# Altium project ELM327-based OBD-II interface.PrjPcb
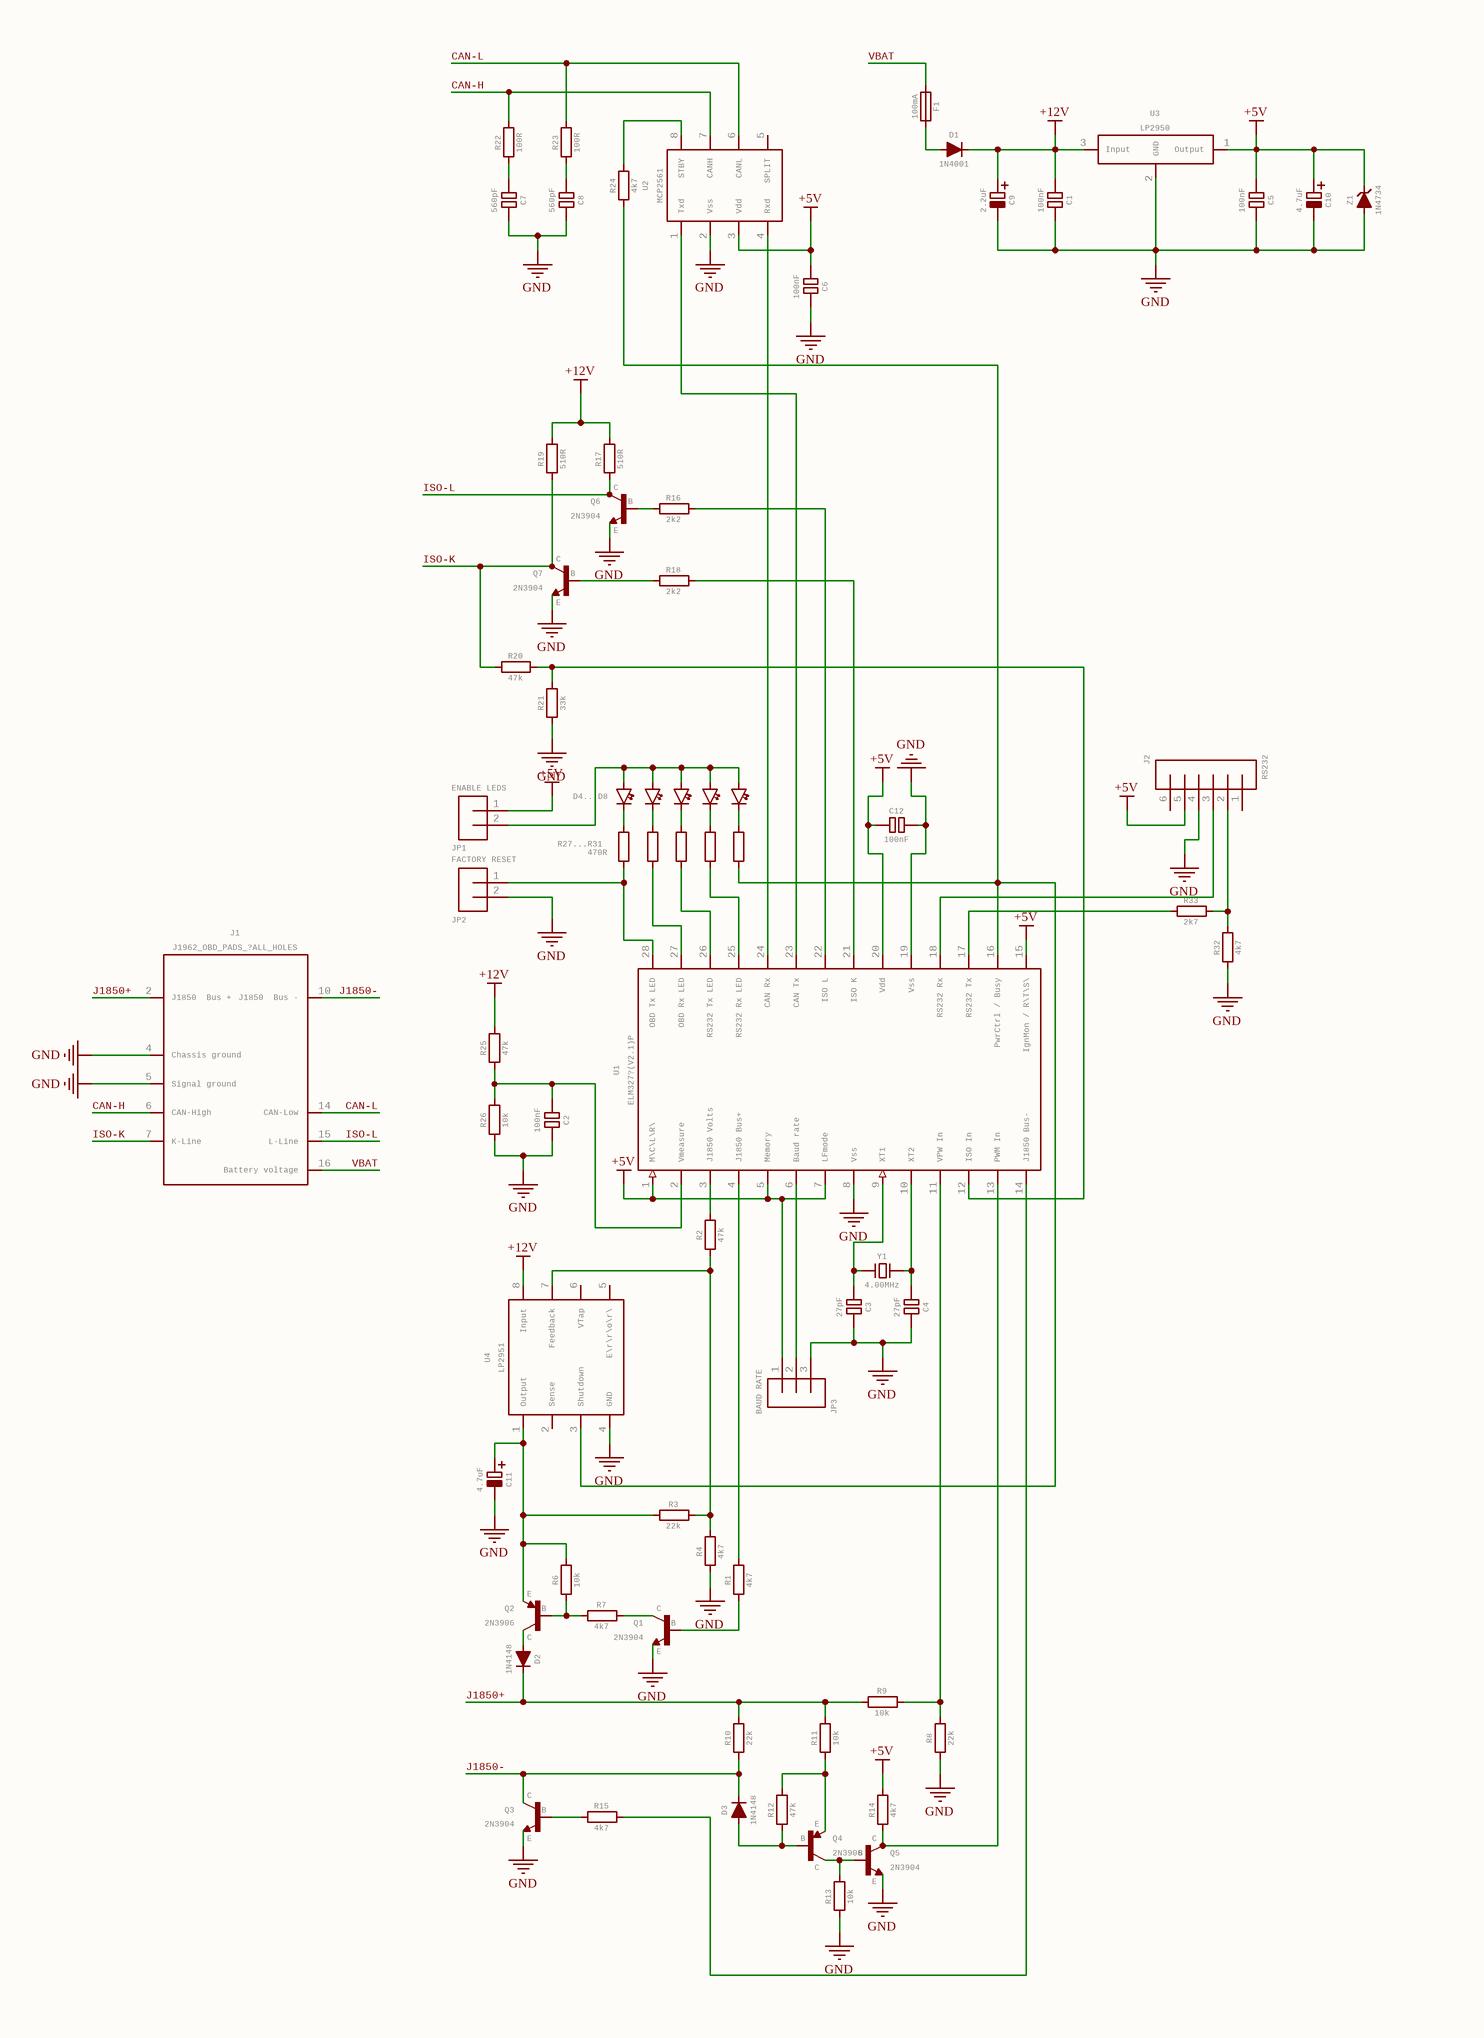
[diagram p0: ELM327-based OBD-II interface.SchDoc]
1 sheet, 71 parts. Net scope: global (net labels, ports and power ports of the same name join across sheets).
Board file: ELM327-based OBD-II interface.PcbDoc

## Sheet ELM327-based OBD-II interface.SchDoc
size 260 x 358 mm; Origin: Eagle; OriginPath: C:\Users\Bimbo\Downloads\ELM327-based OBD-II interface.sch; OriginSheet: 1

### Parts
C1  100nF  [MLCC-5.08]
C2  100nF  [MLCC-5.08]
C3  27pF  [MLCC-5.08]
C4  27pF  [MLCC-5.08]
C5  100nF  [MLCC-5.08]
C6  100nF  [MLCC-5.08]
C7  560pF  [MLCC-5.08]
C8  560pF  [MLCC-5.08]
C9  2.2uF  [E2-5]
C10  4.7uF  [TANTALUM-5.08]
C11  4.7uF  [TANTALUM-5.08]
C12  100nF  [MLCC-5.08]
D1  1N4001  [DO-41]
D2  1N4148  [DO-35]
D3  1N4148  [DO-35]
D4  OBD Tx  [LED_5MM]  (value not drawn)
D5  OBD Rx  [LED_5MM]  (value not drawn)
D6  RS232 Tx  [LED_5MM]  (value not drawn)
D7  RS232 Rx  [LED_5MM]  (value not drawn)
D8  ON  [LED_5MM]  (value not drawn)
F1  100mA  [FUSE]
J1  J1962_OBD_PADS_?ALL_HOLES  J1850
Bus+: J1850 / Bus +  Signalground: Signal ground  J1850
Bus-: J1850 / Bus -  Batteryvoltage: Battery voltage  Chassisground: Chassis ground  [J1962_OBD_PADS_ALL_HOLES]
J2  RS232  [HEADER_1X6]
JP1  ENABLE LEDS  [HEADER_1X2]
JP2  FACTORY RESET  [HEADER_1X2]
JP3  BAUD RATE  [HEADER_1X3]
Q1  2N3904  [TO-92]
Q2  2N3906  [TO-92]
Q3  2N3904  [TO-92]
Q4  2N3906  [TO-92]
Q5  2N3904  [TO-92]
Q6  2N3904  [TO-92]
Q7  2N3904  [TO-92]
R1  4k7  [MF12-1/8W]
R2  47k  [MF12-1/8W]
R3  22k  [MF12-1/8W]
R4  4k7  [MF12-1/8W]
R6  10k  [MF12-1/8W]
R7  4k7  [MF12-1/8W]
R8  22k  [MF12-1/8W]
R9  10k  [MF12-1/8W]
R10  22k  [MF12-1/8W]
R11  10k  [MF12-1/8W]
R12  47k  [MF12-1/8W]
R13  10k  [MF12-1/8W]
R14  4k7  [MF12-1/8W]
R15  4k7  [MF12-1/8W]
R16  2k2  [MF12-1/8W]
R17  510R  [MF50-1/2W]
R18  2k2  [MF12-1/8W]
R19  510R  [MF50-1/2W]
R20  47k  [MF12-1/8W]
R21  33k  [MF12-1/8W]
R22  100R  [MF12-1/8W]
R23  100R  [MF12-1/8W]
R24  4k7  [MF12-1/8W]
R25  47k  [MF12-1/8W]
R26  10k  [MF12-1/8W]
R27  470R  [MF12-1/8W]  (value not drawn)
R28  470R  [MF12-1/8W]  (value not drawn)
R29  470R  [MF12-1/8W]  (value not drawn)
R30  470R  [MF12-1/8W]  (value not drawn)
R31  470R  [MF12-1/8W]  (value not drawn)
R32  4k7  [MF12-1/8W]
R33  2k7  [MF12-1/8W]
U1  ELM327?(V2.1)P  !MCLR: M\C\L\R\  J1850Volts: J1850 Volts  J1850Bus+: J1850 Bus+  Baudrate: Baud rate  VPWIn: VPW In  ISOIn: ISO In  PWMIn: PWM In  J1850Bus-: J1850 Bus-  OBDTxLED: OBD Tx LED  OBDRxLED: OBD Rx LED  RS232TxLED: RS232 Tx LED  RS232RxLED: RS232 Rx LED  CANRx: CAN Rx  CANTx: CAN Tx  ISOL: ISO L  ISOK: ISO K  RS232Rx: RS232 Rx  RS232Tx: RS232 Tx  PwrCtrl/Busy: PwrCtrl / Busy  IgnMon/!RTS: IgnMon / R\T\S\  [SPDIP(28)]
U2  MCP2561  [PDIP]
U3  LP2950  [TO-92]
U4  LP2951  !Error: E\r\r\o\r\  [PDIP-8]
Y1  4.00MHz  [HC49]
Z1  1N4734  [DO-41]

### Nets
+5V: C5.+ C6.+ C10.+ C12.+ J2.5 JP1.1 JP3.1 R14.2 U1.1(~{MCLR}) U1.5(MEMORY) U1.7(LFMODE) U1.15(IGNMON/~{RTS}) U1.20(VDD) U2.3(VDD) U3.1(OUTPUT) Z1.C
+12V: C1.+ C9.+ D1.C R17.2 R19.2 R25.2 U3.3(INPUT) U4.8(INPUT)
GND: C1.- C2.- C3.- C4.- C5.- C6.- C7.- C8.- C9.- C10.- C11.- C12.- J1.4 J1.5 J2.4 JP2.2 JP3.3 Q1.E Q3.E Q5.E Q6.E Q7.E R4.1 R8.1 R13.1 R21.1 R26.1 R32.1 U1.8(VSS) U1.19(VSS) U2.2(VSS) U3.2(GND) U4.4(GND) Z1.A
CAN-H: J1.6 R22.2 U2.7(CANH)
CAN-L: J1.14 R23.2 U2.6(CANL)
ISO-K: J1.7 Q7.C R19.1 R20.1
ISO-L: J1.15 Q6.C R17.1
J1850+: D2.C J1.2 R9.1 R10.2 R11.2
J1850-: D3.C J1.10 Q3.C R10.1
VBAT: F1.1 J1.16
NetC2_+: C2.+ R25.1 R26.2 U1.2(VMEASURE)
NetC3_+: C3.+ U1.9(XT1) Y1.1
NetC4_+: C4.+ U1.10(XT2) Y1.2
NetC7_+: C7.+ R22.1
NetC8_+: C8.+ R23.1
NetC11_+: C11.+ Q2.E R3.1 R6.2 U4.1(OUTPUT)
NetD1_A: D1.A F1.2
NetD2_A: D2.A Q2.C
NetD3_A: D3.A Q4.B R12.1
NetD4_A: D4.A D5.A D6.A D7.A D8.A JP1.2
NetD4_C: D4.C R27.2
NetD5_C: D5.C R28.2
NetD6_C: D6.C R29.2
NetD7_C: D7.C R30.2
NetD8_C: D8.C R31.2
NetJ2_2: J2.2 R32.2 R33.2
NetJ2_3: J2.3 U1.18(RS232_RX)
NetJP2_1: JP2.1 R27.1 U1.28(OBD_TX_LED)
NetJP3_2: JP3.2 U1.6(BAUD_RATE)
NetQ1_B: Q1.B R1.1
NetQ1_C: Q1.C R7.2
NetQ2_B: Q2.B R6.1 R7.1
NetQ3_B: Q3.B R15.1
NetQ4_C: Q4.C Q5.B R13.2
NetQ4_E: Q4.E R11.1 R12.2
NetQ5_C: Q5.C R14.1 U1.13(PWM_IN)
NetQ6_B: Q6.B R16.1
NetQ7_B: Q7.B R18.1
NetR1_2: R1.2 U1.4(J1850_BUS+)
NetR2_1: R2.1 R3.2 R4.2 U4.7(FEEDBACK)
NetR2_2: R2.2 U1.3(J1850_VOLTS)
NetR8_2: R8.2 R9.2 U1.11(VPW_IN)
NetR15_2: R15.2 U1.14(J1850_BUS-)
NetR16_2: R16.2 U1.22(ISO_L)
NetR18_2: R18.2 U1.21(ISO_K)
NetR20_2: R20.2 R21.2 U1.12(ISO_IN)
NetR24_1: R24.1 R31.1 U1.16(PWRCTRL/BUSY) U4.3(SHUTDOWN)
NetR24_2: R24.2 U2.8(STBY)
NetR28_1: R28.1 U1.27(OBD_RX_LED)
NetR29_1: R29.1 U1.26(RS232_TX_LED)
NetR30_1: R30.1 U1.25(RS232_RX_LED)
NetR33_1: R33.1 U1.17(RS232_TX)
NetU1_23: U1.23(CAN_TX) U2.1(TXD)
NetU1_24: U1.24(CAN_RX) U2.4(RXD)

Not connected (* = marked no-connect by the designer): J2 1 6; U2 5(SPLIT); U4 2(SENSE) 5(ERROROUTPUT) 6(VOTAP)

### Notes on the sheet
- (near D4) D4...D8
- (near R27) R27...R31
  470R

### Library data of the parts
C1-C8 C12 = C(MLCC-5.08): GateName_1: G$1; SymbolName_1: C; DeviceName: (MLCC-5.08); LibraryName: Capacitor; DeviceSetName: C
C9 = CPOL(E2-5): GateName_1: G$1; SymbolName_1: CPOL; DeviceName: (E2-5); LibraryName: Capacitor; DeviceSetName: CPOL
C10 C11 = CPOL(TANTALUM-5.08): GateName_1: G$1; SymbolName_1: CPOL; DeviceName: (TANTALUM-5.08); LibraryName: Capacitor; DeviceSetName: CPOL
D1 = DIODE(?)DO-41: Diode; GateName_1: G$1; SymbolName_1: DIODE; DeviceName: DO-41; LibraryName: diode; DeviceSetName: DIODE(?)
D2 D3 = DIODE(?)DO-35: Diode; GateName_1: G$1; SymbolName_1: DIODE; DeviceName: DO-35; LibraryName: diode; DeviceSetName: DIODE(?)
D4-D8 = LED(?)5MM: GateName_1: G$1; SymbolName_1: LED; DeviceName: 5MM; DeviceSetName: LED(?); LibraryName: diode
F1 = FUSE: GateName_1: G$1; SymbolName_1: FUSE; LibraryName: fuse; DeviceSetName: FUSE
J1 = J1962_OBD_PADS_?ALL_HOLES: GateName_1: G$1; SymbolName_1: J1962_OBD_ONLY; DeviceName: ALL_HOLES; LibraryName: J1962; DeviceSetName: J1962_OBD_PADS_?; CAN-High: CAN-High; K-Line: K-Line; CAN-Low: CAN-Low; L-Line: L-Line
J2 = HEADER_1X6: GateName_1: G$1; SymbolName_1: HEADER_1X6; LibraryName: HEADERS; DeviceSetName: HEADER_1X6
JP1 JP2 = HEADER_1X2: GateName_1: G$1; SymbolName_1: HEADER_1X2; LibraryName: HEADERS; DeviceSetName: HEADER_1X2
JP3 = HEADER_1X3: GateName_1: G$1; SymbolName_1: HEADER_1X3; LibraryName: HEADERS; DeviceSetName: HEADER_1X3
Q1 Q3 Q5-Q7 = NPN(TO-92): GateName_1: G$1; SymbolName_1: NPN; DeviceName: (TO-92); LibraryName: Transistor; DeviceSetName: NPN; C: C; E: E; B: B
Q2 Q4 = PNP(TO-92): GateName_1: G$1; SymbolName_1: PNP; DeviceName: (TO-92); LibraryName: Transistor; DeviceSetName: PNP; C: C; E: E; B: B
R1-R4 R6-R16 R18 R20-R33 = R-EU-?MF12-1/8W: GateName_1: G$1; SymbolName_1: R-EU; DeviceSetName: R-EU-?; DeviceName: MF12-1/8W; LibraryName: Resistor
R17 R19 = R-EU-?MF50-1/2W: GateName_1: G$1; SymbolName_1: R-EU; DeviceSetName: R-EU-?; DeviceName: MF50-1/2W; LibraryName: Resistor
U1 = ELM327?(V2.1)P: ELM327 - OBD to RS232 Interpreter (v2.1) based on Microchip Technology Inc.'s PIC18F2480 (www.microchip.com)    All versions of the ELM327 support the standard OBDII protocols. In addition, the IC supports various other protocols to varying degrees.   Version 2.1 is the most recent revision.   More info on Elm Electronics Inc..; GateName_1: G$1; SymbolName_1: ELM327-V2.1; DeviceName: P; LibraryName: Elm Electronics; DeviceSetName: ELM327?(V2.1); Vmeasure: Vmeasure; Memory: Memory; LFmode: LFmode; Vss: Vss; XT1: XT1; XT2: XT2; Vdd: Vdd
U2 = MCP2561FD(?)PDIP: High-Speed CAN Flexible Data Rate Transceiver; GateName_1: G$1; SymbolName_1: MCP2561FD; DeviceName: PDIP; LibraryName: Microchip MCP2561; DeviceSetName: MCP2561FD(?); Txd: Txd; Vss: Vss; Vdd: Vdd; Rxd: Rxd; STBY: STBY; CANH: CANH; CANL: CANL; SPLIT: SPLIT
U3 = LP2950*?Z-5.0: GateName_1: G$1; DeviceName: Z-5.0; OUTPUT_VOLTAGE: 5.0 V; OUTPUT_VOLTAGE_PRECISION: 0.5%; SymbolName_1: LP2950; LibraryName: ON Semiconductor LP2950, LP2951, NCV2951; DeviceSetName: LP2950*?; Output: Output; Input: Input; GND: GND
U4 = LP2951*?N: GateName_1: G$1; DeviceName: N; OUTPUT_VOLTAGE: 5.0 V or Adjustable; OUTPUT_VOLTAGE_PRECISION: 0.5%; SymbolName_1: LP2951; LibraryName: ON Semiconductor LP2950, LP2951, NCV2951; DeviceSetName: LP2951*?; Output: Output; Sense: Sense; Shutdown: Shutdown; GND: GND; Input: Input; Feedback: Feedback; VTap: VTap
Y1 = HUS-4.000-18-30/50/-40+85: GateName_1: G$1; SymbolName_1: CRYSTAL; LibraryName: crystal; DeviceSetName: HUS-4.000-18-30/50/-40+85
Z1 = ZENER(?)DO-41: GateName_1: G$1; SymbolName_1: ZENER; DeviceName: DO-41; LibraryName: diode; DeviceSetName: ZENER(?)